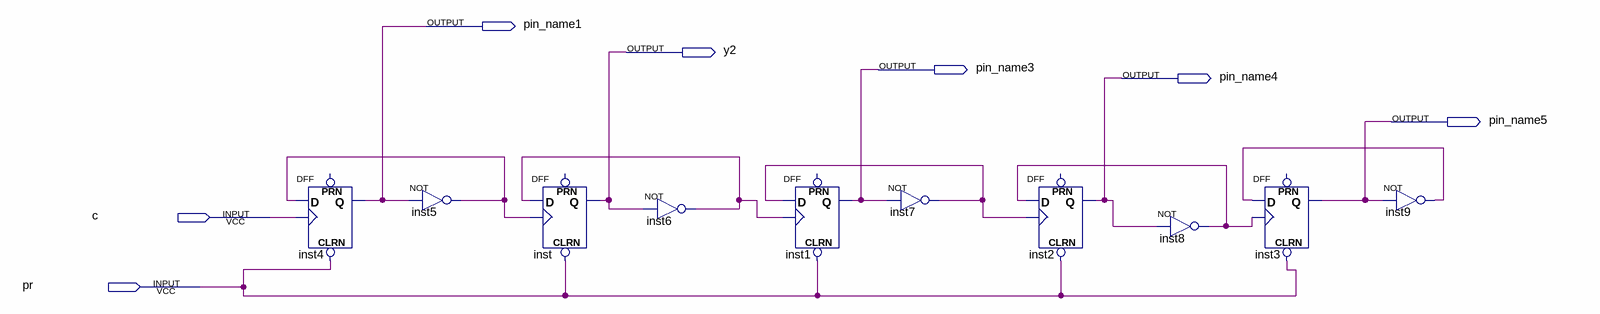
[diagram p0: schematic sheet]
// Quartus schematic couter_dtrig.bdf as structural Verilog: 10 symbols, 7 pins
module couter_dtrig (
  input  c,
  input  pr,
  output pin_name1,
  output y2,
  output pin_name3,
  output pin_name4,
  output pin_name5
);

  wire inst5_out, inst6_out, inst7_out, inst8_out, inst9_out;

  DFF inst4 (.CLRN(pr), .CLK(c), .D(inst5_out), .Q(pin_name1));  // open: PRN
  not inst5 (inst5_out, pin_name1);
  DFF inst (.CLRN(pr), .CLK(inst5_out), .D(inst6_out), .Q(y2));  // open: PRN
  not inst6 (inst6_out, y2);
  DFF inst1 (.CLRN(pr), .CLK(inst6_out), .D(inst7_out), .Q(pin_name3));  // open: PRN
  not inst7 (inst7_out, pin_name3);
  DFF inst2 (.CLRN(pr), .CLK(inst7_out), .D(inst8_out), .Q(pin_name4));  // open: PRN
  not inst8 (inst8_out, pin_name4);
  DFF inst3 (.CLRN(pr), .CLK(inst8_out), .D(inst9_out), .Q(pin_name5));  // open: PRN
  not inst9 (inst9_out, pin_name5);
endmodule
